# Altium schematic sheet pool_mesurement_circuit.SchDoc
size A3
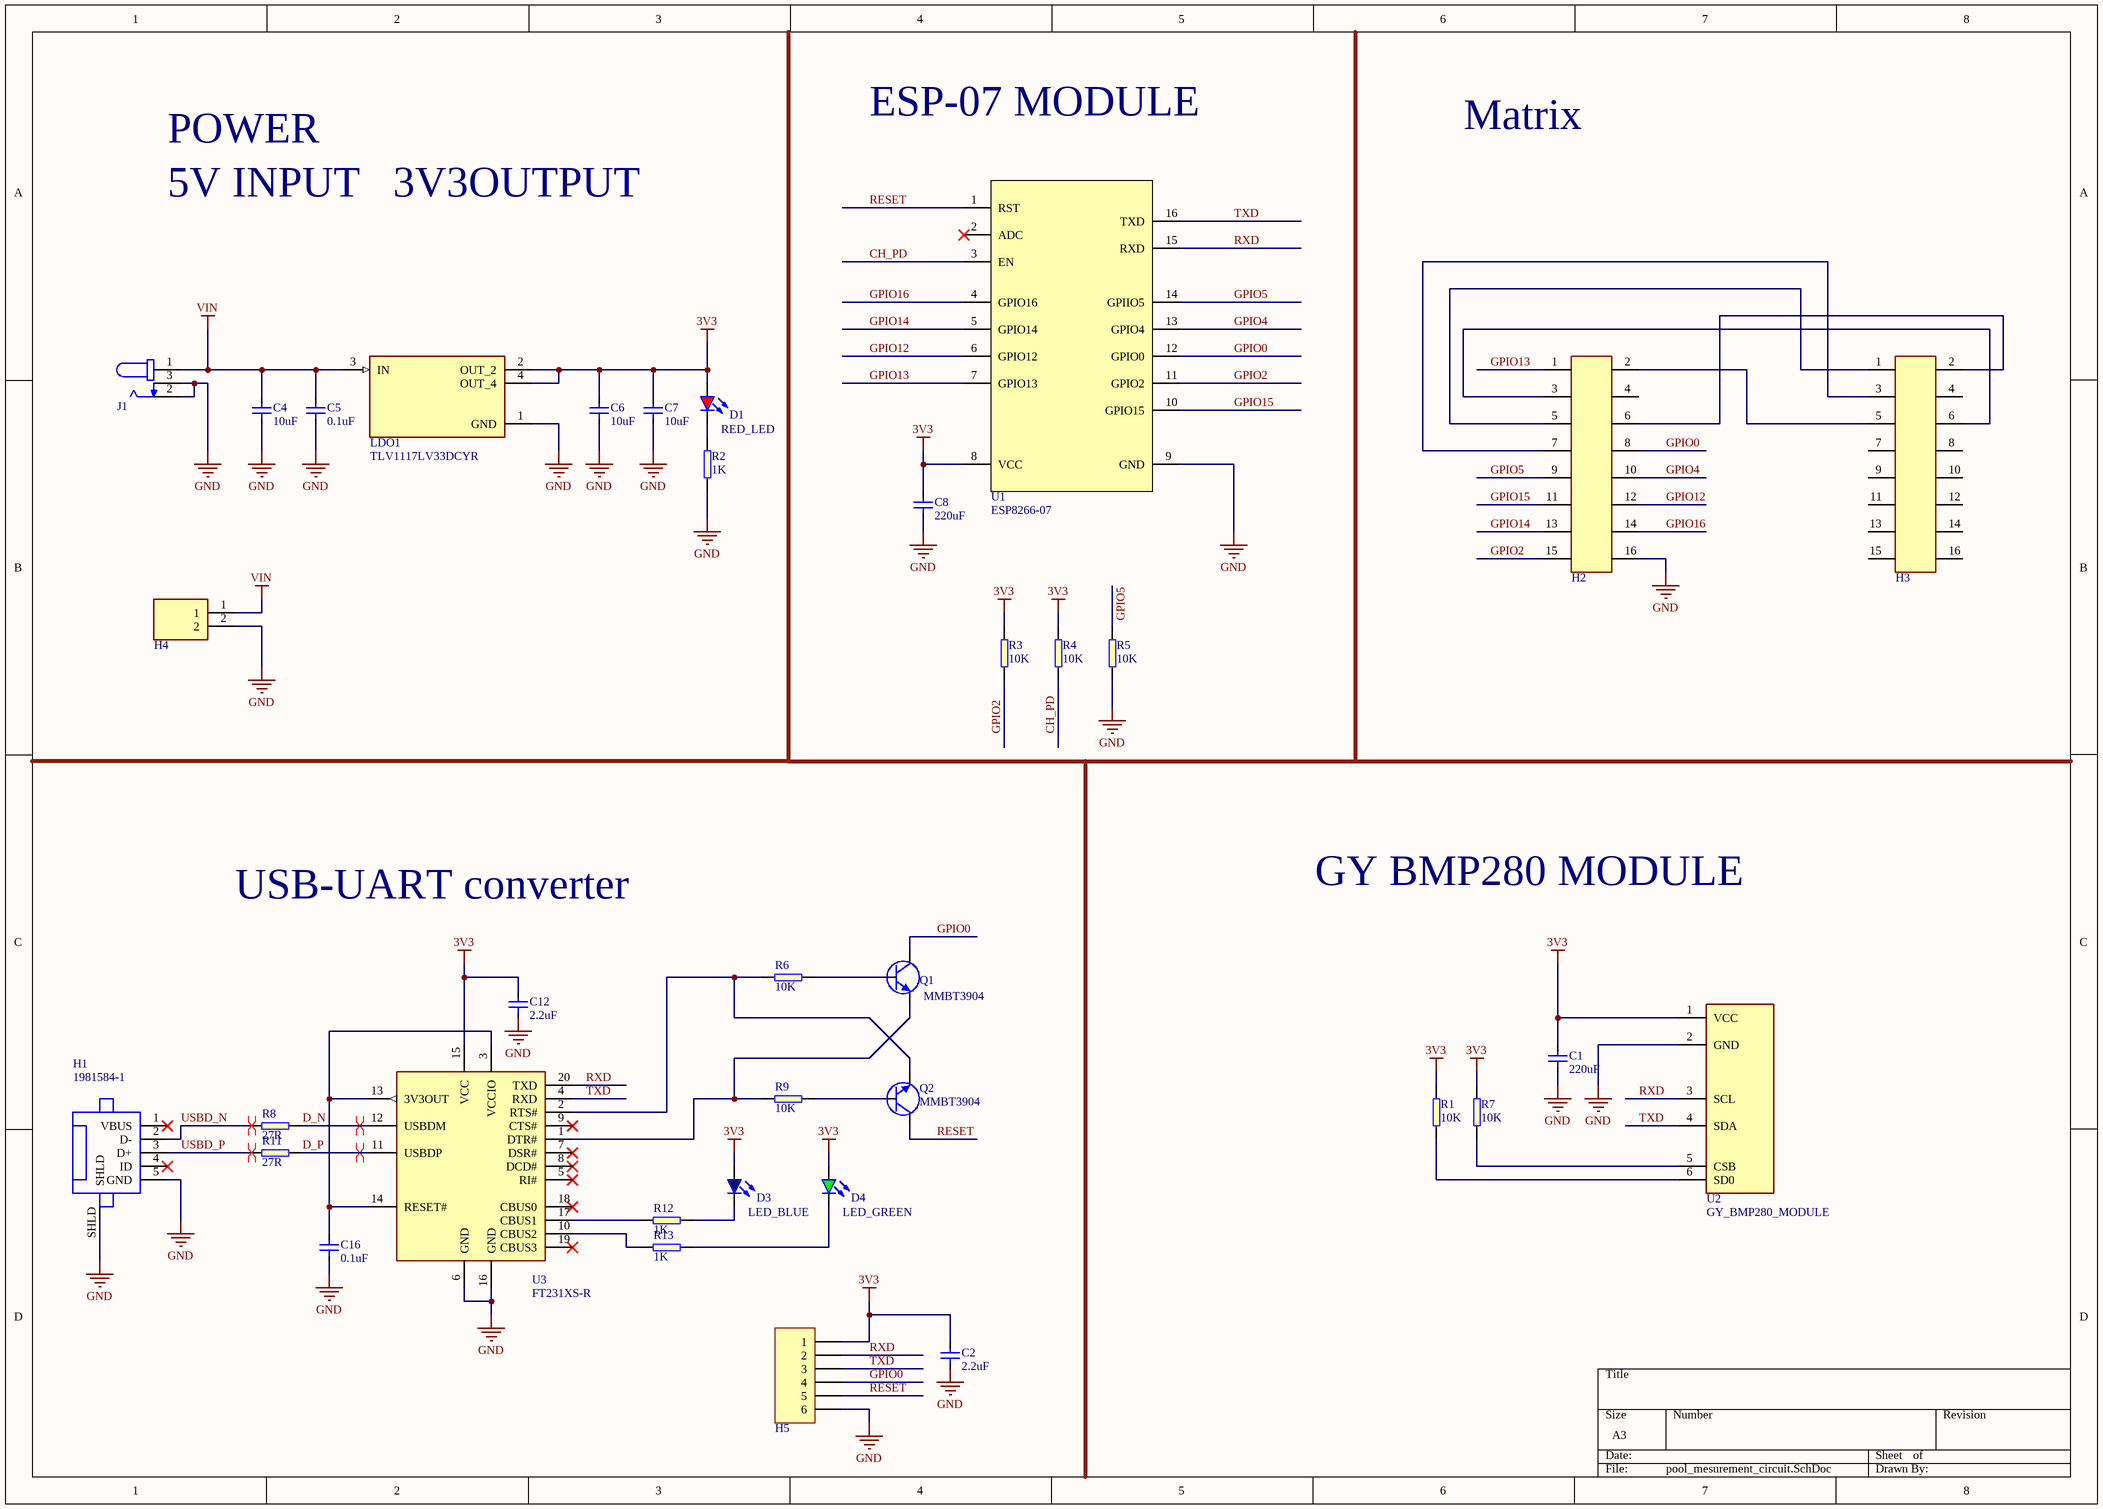
[diagram p0: pool_mesurement_circuit.SchDoc]

## Parts
C1  220uF  [C3216]
C2  2.2uF  [C3216]
C4  10uF  [C3216]
C5  0.1uF  [C3216]
C6  10uF  [C3216]
C7  10uF  [C3216]
C8  220uF  [C3216]
C12  2.2uF  [C3216]
C16  0.1uF  [C3216]
D1  RED_LED  [LED0603-RED]
D3  LED_BLUE  [LED0603-BLUE]
D4  LED_GREEN  [LED0603-GRENN]
H1  1981584-1  [1981584-1]
H2  PPTC082LFBN-RC  [PPTC082LFBN-RC]  (value not drawn)
H3  302-R161  [302-R161]  (value not drawn)
H4  TB002-500-02BE  [TB002-500-02BE]  (value not drawn)
H5  PH1-06-UA  [PH1-06-UA]  (value not drawn)
J1  PJ-002A  [PJ-002A]  (value not drawn)
LDO1  TLV1117LV33DCYR  [TLV1117LV33DCYR]
Q1  MMBT3904  [MMBT3904]
Q2  MMBT3904  [MMBT3904]
R1  10K  [R3216]
R2  1K  [R3216]
R3  10K  [R3216]
R4  10K  [R3216]
R5  10K  [R3216]
R6  10K  [R3216]
R7  10K  [R3216]
R8  27R  [R3216]
R9  10K  [R3216]
R11  27R  [R3216]
R12  1K  [R3216]
R13  1K  [R3216]
U1  ESP8266-07  [ESP8266-07_MODULE]
U2  GY_BMP280_MODULE  [BMP280_MODULE]
U3  FT231XS-R  [FT231XS-R]

## Nets
3V3: C1.2 C2.2 C6.2 C7.2 C8.2 C12.2 D1.A D3.A D4.A H5.1 LDO1.2(OUT_2) LDO1.4(OUT_4) R1.2 R3.2 R4.2 R7.2 U1.8(VCC) U2.1(VCC) U3.15(VCC)
GND: C1.1 C2.1 C4.1 C5.1 C6.1 C7.1 C8.1 C12.1 C16.1 H1.5(GND) H1.SHLD H2.16 H4.2 H5.6 J1.2 J1.3 LDO1.1(GND) R2.1 R5.1 U1.9(GND) U2.2(GND) U3.6(GND) U3.16(GND)
VIN: C4.2 C5.2 H4.1 J1.1 LDO1.3(IN)
CH_PD: R4.1 U1.3(EN)
D_N: R8.2 U3.12(USBDM)
D_P: R11.2 U3.11(USBDP)
GPIO0: H2.8 H5.4 Q1.3(C) U1.12(GPIO0)
GPIO2: H2.15 R3.1 U1.11(GPIO2)
GPIO4: H2.10 U1.13(GPIO4)
GPIO5: H2.9 R5.2 U1.14(GPIIO5)
GPIO12: H2.12 U1.6(GPIO12)
GPIO13: H2.1 U1.7(GPIO13)
GPIO14: H2.13 U1.5(GPIO14)
GPIO15: H2.11 U1.10(GPIO15)
GPIO16: H2.14 U1.4(GPIO16)
RESET: H5.5 Q2.3(C) U1.1(RST)
RXD: H5.2 U1.15(RXD) U2.3(SCL) U3.20(TXD)
TXD: H5.3 U1.16(TXD) U2.4(SDA) U3.4(RXD)
USBD_N: H1.2(D-) R8.1
USBD_P: H1.3(D+) R11.1
NetC16_2: C16.2 U3.3(VCCIO) U3.13(3V3OUT) U3.14(RESET#)
NetD1_K: D1.K R2.2
NetD3_K: D3.K R12.1
NetD4_K: D4.K R13.1
NetH2_2: H2.2 H3.5
NetH2_3: H2.3 H3.6
NetH2_5: H2.5 H3.1
NetH2_6: H2.6 H3.2
NetH2_7: H2.7 H3.3
NetQ1_1: Q1.1(B) R6.1
NetQ1_2: Q1.2(E) R9.2 U3.1(DTR#)
NetQ2_1: Q2.1(B) R9.1
NetQ2_2: Q2.2(E) R6.2 U3.2(RTS#)
NetR1_1: R1.1 U2.6(SD0)
NetR7_1: R7.1 U2.5(CSB)
NetR12_2: R12.2 U3.17(CBUS1)
NetR13_2: R13.2 U3.10(CBUS2)

Not connected (* = marked no-connect by the designer): H1 1(VBUS)* 4(ID)*; H2 4; H3 4 7 8 9 10 11 12 13 14 15 16; U1 2(ADC)*; U3 5(RI#)* 7(DSR#)* 8(DCD#)* 9(CTS#)* 18(CBUS0)* 19(CBUS3)*

## Layout directives
differential pair: D_N, D_P, USBD_N, USBD_P

## Notes on the sheet
- POWER
- ESP-07 MODULE
- Matrix
- 5V INPUT   3V3OUTPUT
- USB-UART converter
- GY BMP280 MODULE

## Library data of the parts
C1 C8 = C_220u_3216: SMD capacitor X6S(EIA) with capacitance 220uF Tol.20%. Rated voltage 4Vdc 105C; Manufacturer: Murata Electronics; Mfr.PN: GRM31CC80G227ME11L
C2 C12 = C_2u2_3216: ±10% 25V Ceramic Capacitor X7R 1206 (3216 Metric); Manufacturer: Samsung Electro-Mechanics; Mfr.PN: CL31B225KAHNNNE
C4 C6 C7 = C_10u_3216: -20%, +80% 10V Ceramic Capacitor Y5V (F) 1206 (3216 Metric); Manufacturer: Samsung Electro-Mechanics; Mfr.PN: CL31F106ZPHNNNE
C5 C16 = C_100n_3216: ±10% 50V Ceramic Capacitor X7R 1206 (3216 Metric); Manufacturer: Samsung Electro-Mechanics; Mfr.PN: CL31B104KBCNNNC
D1 = LED_RED: Red 630nm LED Indication - Discrete 1.9V 0603 (1608 Metric); Manufacturer: Würth Elektronik; Mfr.PN: 150060SS75000
D3 = LED_BLUE: Blue 470nm LED Indication - Discrete 3.2V 0603 (1608 Metric); Manufacturer: Würth Elektronik; Mfr.PN: 150060BS75000
D4 = LED_GREEN: Green 520nm LED Indication - Discrete 3.2V 0603 (1608 Metric); Manufacturer: Würth Elektronik; Mfr.PN: 150060GS75000
H1 = 1981584-1: Conn Micro USB 2.0 Type AB RCP 5 POS 0.65mm Solder RA SMD 5 Terminal 1 Port T/R; Manufacturer: TE Connectivity; Mfr.PN: 1981584-1
H2 = PPTC082LFBN-RC: 16 Position Header Connector Through Hole; Manufacturer: Sullins Connector Solutions; ComponentLink2Description: Datasheet; ComponentLink1URL: https://upverter.com/upn/revision/f2f20904236b1696/; ComponentLink1Description: Upverter; ComponentLink2URL: http://cdn.amphenol-icc.com/media/wysiwyg/files/drawing/67996.pdf; Mfr.PN: PPTC082LFBN-RC
H3 = 302-R161: CONN HEADER R/A 16POS 2.54MM; Manufacturer: On Shore Technology Inc.; ComponentLink2Description: Datasheet; ComponentLink1URL: https://upverter.com/upn/revision/90d2834b771e9b5c/; ComponentLink1Description: Upverter; ComponentLink2URL: http://www.on-shore.com/wp-content/uploads/2015/09/ipg33_0.pdf; Mfr.PN: 302-R161
H4 = TB002-500-02BE: 2~24 Poles, Screw Type, Horizontal, 5.0 Pitch, 22~12 _AWG_, Terminal Block Connector; Manufacturer: CUI Devices; Mfr.PN: TB002-500-02BE
H5 = PH1-06-UA: Connector Header Through Hole 6 position 0.100" (2.54mm); Manufacturer: Adam Tech; Mfr.PN: PH1-06-UA
J1 = PJ-002A: 2,0 x 6,5 mm, 2,5 A, Yatay, AÃ§Ä±k Delik, Dc GÃ¼Ã§ JakÄ± KonnektÃ¶rÃ¼; Manufacturer: CUI Devices; Mfr.PN: PJ-002A
LDO1 = TLV1117LV33DCYR: 1-A, low-dropout voltage regulator 4-SOT-223 -40 to 125; Manufacturer: Texas Instruments; Mfr.PN: TLV1117LV33DCYR
Q1 Q2 = MMBT3904: Bipolar _BJT_ Transistor NPN 40V 200mA 270MHz 350mW Surface Mount SOT-23-3; Manufacturer: STMicroelectronics; Mfr.PN: MMBT3904
R1 R3-R7 R9 = R_10k_3216: 10 ±1% 0.25W, 1/4W Chip Resistor 1206 (3216 Metric) Automotive AEC-Q200 Thick Film; Manufacturer: RMCF1206FT10K0; Mfr.PN: Stackpole Electronics Inc
R2 R12 R13 = R_1k_3216: 1 ±1% 0.25W, 1/4W Chip Resistor 1206 (3216 Metric) Automotive AEC-Q200 Thick Film /; Manufacturer: Stackpole Electronics Inc; Mfr.PN: RMCF1206FT1K00
R8 R11 = R_27R_3216: 27 ±5% 0.25W, 1/4W Chip Resistor 1206 (3216 Metric) Automotive AEC-Q200 Thick Film; Manufacturer: Stackpole Electronics Inc; Mfr.PN: RMCF1206JT27R0
U1 = ESP8266-07: self-contained Wi-Fi network solution; Manufacturer: Reland Sung; Mfr.PN: 722704676397
U2 = GY_BMP280_MODULE: environmental sensor with temperature, barometric pressure; Manufacturer: KOOBOOK; Mfr.PN: KB039
U3 = FT231XS-R: USB Bridge, USB to UART USB 2.0 UART Interface 20-SSOP; Manufacturer: FTDI; Mfr.PN: FT231XS-R